# Altium schematic sheet Chov2_cpu.SchDoc
size A4; DocumentNumber: 2; SheetNumber: 2; SheetTotal: 3; LotOfPieces: 1
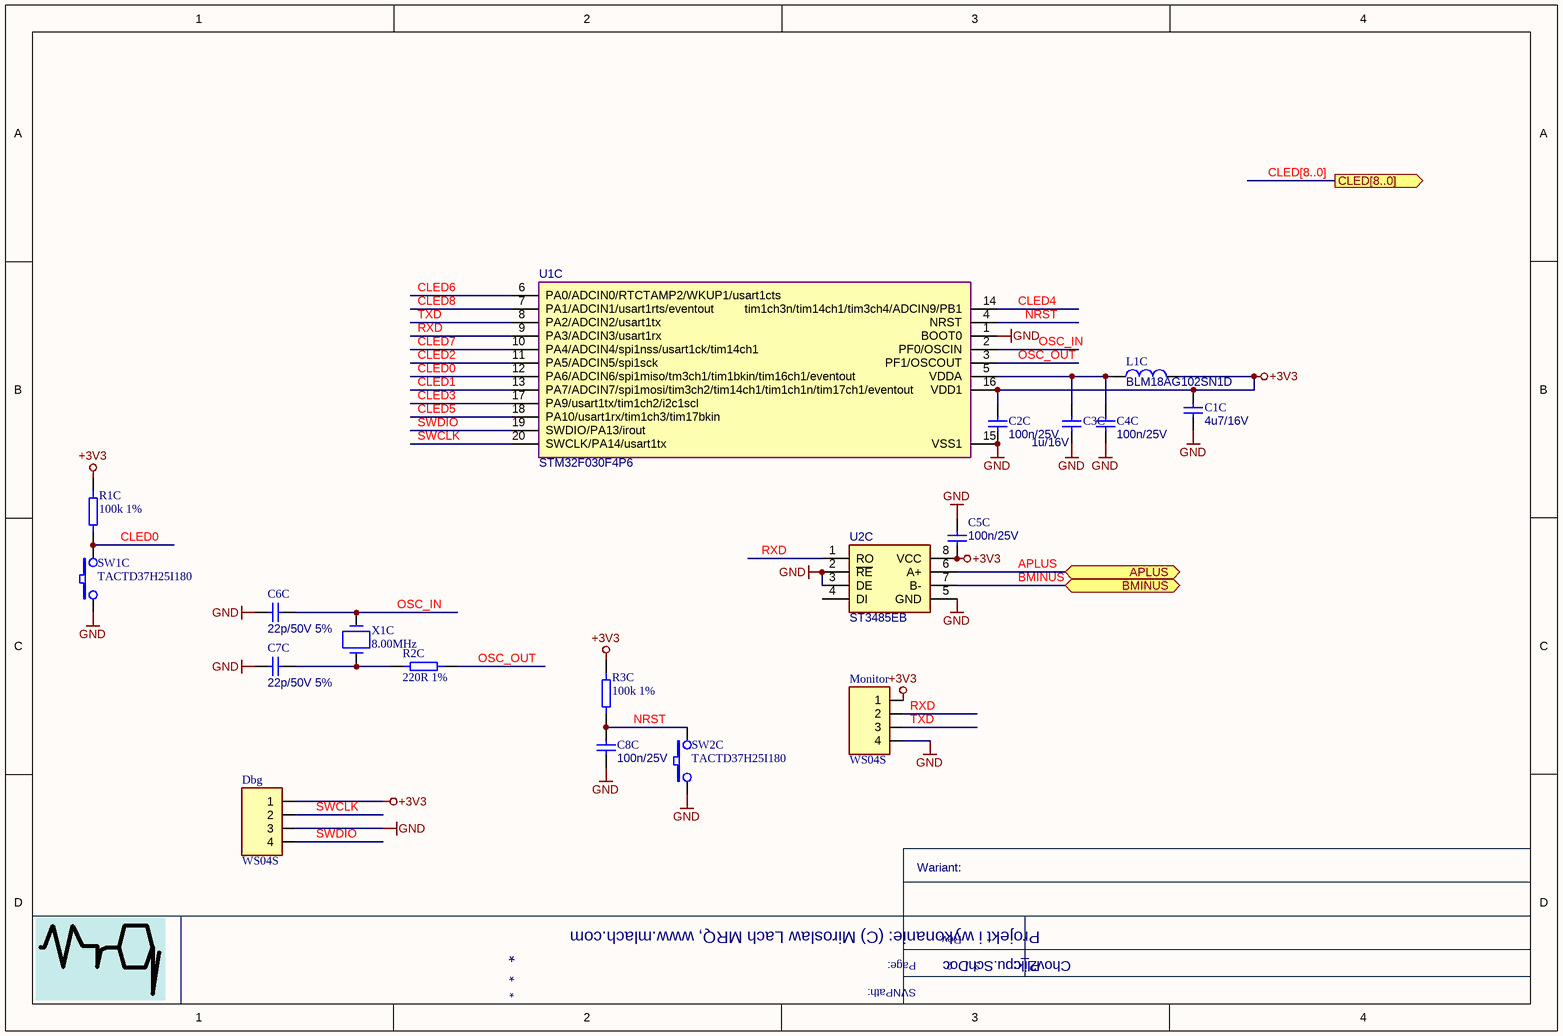
[diagram p0: Chov2_cpu.SchDoc]

## Parts
C1C  OtherParams: 4u7/16V  [0805]  (hidden comment: 0805YC475KAT2A)
C2C  OtherParams: 100n/25V  [0603-IPC]  (hidden comment: CL10B104KA8NNNC)
C3C  OtherParams: 1u/16V  [0603-IPC]  (hidden comment: CL10B105KO8NNNC)
C4C  OtherParams: 100n/25V  [0603-IPC]  (hidden comment: CL10B104KA8NNNC)
C5C  OtherParams: 100n/25V  [0603-IPC]  (hidden comment: CL10B104KA8NNNC)
C6C  OtherParams: 22p/50V 5%  [0603-IPC]  (hidden comment: CL10C220JB8NNNC)
C7C  OtherParams: 22p/50V 5%  [0603-IPC]  (hidden comment: CL10C220JB8NNNC)
C8C  OtherParams: 100n/25V  [0603-IPC]  (hidden comment: CL10B104KA8NNNC)
Dbg  WS04S  [WS04S]
L1C  BLM18AG102SN1D  [0603]
Monitor  WS04S  [WS04S]
R1C  OtherParams: 100k 1%  [0603-IPC]  (hidden comment: RC0603FR-07100KL)
R2C  OtherParams: 220R 1%  [0603-IPC]  (hidden comment: 0603SAF2200T5E)
R3C  OtherParams: 100k 1%  [0603-IPC]  (hidden comment: RC0603FR-07100KL)
SW1C  TACTD37H25I180  [TACTD37H25I180]
SW2C  TACTD37H25I180  [TACTD37H25I180]
U1C  STM32F030F4P6  [MO-153AC]
U2C  ST3485EB  [8SOIC150]
X1C  8.00MHz  [HC49SMP]

## Ports
APLUS, BMINUS, CLED[8..0]

## Nets
+3V3: C1C.1 C2C.1 C5C.1 Dbg.1 L1C.2 Monitor.1 R1C.1 R3C.1 U1C.16(VDD1) U2C.8(VCC)
GND: C1C.2 C2C.2 C3C.2 C4C.2 C5C.2 C6C.1 C7C.1 C8C.2 Dbg.3 Monitor.4 SW1C.1 SW2C.1 U1C.1(BOOT0) U1C.15(VSS1) U2C.2(~{RE}) U2C.3(DE) U2C.5(GND)
APLUS: U2C.6(A+) ; port APLUS
BMINUS: U2C.7(B-) ; port BMINUS
CLED0: R1C.2 SW1C.2 U1C.12(PA6/ADCIN6/spi1miso/tm3ch1/tim1bkin/tim16ch1/eventout)
CLED1: U1C.13(PA7/ADCIN7/spi1mosi/tim3ch2/tim14ch1/tim1ch1n/tim17ch1/eventout)
CLED2: U1C.11(PA5/ADCIN5/spi1sck)
CLED3: U1C.17(PA9/usart1tx/tim1ch2/i2c1scl)
CLED4: U1C.14(tim1ch3n/tim14ch1/tim3ch4/ADCIN9/PB1)
CLED5: U1C.18(PA10/usart1rx/tim1ch3/tim17bkin)
CLED6: U1C.6(PA0/ADCIN0/RTCTAMP2/WKUP1/usart1cts)
CLED7: U1C.10(PA4/ADCIN4/spi1nss/usart1ck/tim14ch1)
CLED8: U1C.7(PA1/ADCIN1/usart1rts/eventout)
NRST: C8C.1 R3C.2 SW2C.2 U1C.4(NRST)
OSC_IN: C6C.2 U1C.2(PF0/OSCIN) X1C.1
OSC_OUT: R2C.2 U1C.3(PF1/OSCOUT)
RXD: Monitor.2 U1C.9(PA3/ADCIN3/usart1rx) U2C.1(RO)
SWCLK: Dbg.2 U1C.20(SWCLK/PA14/usart1tx)
SWDIO: Dbg.4 U1C.19(SWDIO/PA13/irout)
TXD: Monitor.3 U1C.8(PA2/ADCIN2/usart1tx)
NetC3C_1: C3C.1 C4C.1 L1C.1 U1C.5(VDDA)
NetC7C_2: C7C.2 R2C.1 X1C.2

Not connected (* = marked no-connect by the designer): U2C 4(DI)

## Buses and harness runs
bus CLED[8..0] = port CLED[8..0]

## Notes on the sheet
- Wariant:
- Projekt i wykonanie: (C) Miroslaw Lach MRQ, www.mlach.com
- SVNPath:
- Page:
- Rev.
- /
- Plik:

## Library data of the parts
C1C = 0805YC475KAT2A[[/\]]0805[[/\]]16V[[/\]]10%[[/\]]4u7/16V: MaxVoltage: 16V; Tolerance: 10%; Descript: capacitor 4.7uF,16V, X7R, 0805; Currency5: PLN; Value: 0805YC475KAT2A; Dimensions: 0805; ComponentLink1Description: Datasheet; ComponentLink1URL: http://www.mrq-ml.com/Parts/Capacitors/AVX_smccp.pdf; Supplier5: tme.pl; Reference5: 0805YC475KAT2A; Manufacturer5: AVX; Typ5: 0805YC475KAT2A; Price5: 0,0249; DateOfPrice5: 2012-07-30
C2C C4C C5C C8C = CL10B104KA8NNNC[[/\]]0603[[/\]]25V[[/\]]10%[[/\]]100n/25V: MaxVoltage: 25V; Tolerance: 10%; Descript: Kondensator: ceramiczny; MLCC; 100nF; 25V; X7R; ±10%; SMD; 0603; Currency5: PLN; Value: CL10B104KA8NNNC; Dimensions: 0603; Supplier5: tme.pl; Reference5: CL10B104KA8NNNC; Manufacturer5: Samsung; Typ5: CL10B104KA8NNNC; Price5: 0,0239; DateOfPrice5: 2014-08-05
C3C = CL10B105KO8NNNC[[/\]]0603[[/\]]16V[[/\]]10%[[/\]]1u/16V: MaxVoltage: 16V; Tolerance: 10%; Descript: capacitor 1uF, 16V, 0603, 10%, X7R; Currency5: PLN; Value: CL10B105KO8NNNC; Dimensions: 0603; Supplier5: tme.pl; Reference5: CL10B105KO8NNNC; Manufacturer5: Samsung; Typ5: CL10B105KO8NNNC; Price5: 0,0299; DateOfPrice5: 2014-09-29; Price1: 0,0199
C6C C7C = CL10C220JB8NNNC[[/\]]0603[[/\]]50V[[/\]]5%[[/\]]22p/50V 5%: MaxVoltage: 50V; Tolerance: 5%; Descript: capacitor 22pF, 50V, 5%, 0603; Currency5: PLN; Value: CL10C220JB8NNNC; Dimensions: 0603; ComponentLink1Description: Datasheet; ComponentLink1URL: http://www.mrq-ml.com/Parts/Capacitors/mlcc_samsung.pdf; Supplier5: tme.pl; Reference5: CL10C220JB8NNNC; Manufacturer5: Samsung; Typ5: CL10C220JB8NNNC; Price5: 0,027; DateOfPrice5: 2012-02-08
Dbg Monitor = WS04S[[/\]]8x12mm: Descript: connector 2mm pitch, THT, 4 pole, straight, male; Currency5: PLN; Replacement: maritex: NXW-04; Value: WS04S; Dimensions: 8x12mm; ComponentLink1Description: Datasheet; ComponentLink1URL: http://www.mrq-ml.com/Parts/Connectors/WS-S.pdf; Supplier5: maritex.com.pl; Reference5: WS04S; Price5: 0,069; DateOfPrice5: 2012-09-18
L1C = BLM18AG102SN1D[[/\]]0603[[/\]]BLM18AG102SN1D: Descript: Chip inductor SMD, 0603, Imax=0.4A,Z=1000ohm,  Rdc=0.15ohm; Currency5: PLN; Value: BLM18AG102SN1D; OtherParams: BLM18AG102SN1D; Dimensions: 0603; Supplier5: tme.pl; Reference5: BLM18AG102SN1D; Manufacturer5: Murata; Typ5: BLM18AG102SN1D; Price5: 0,069; DateOfPrice5: 2014-10-18; Price1: 0,049
R1C = RC0603FR-07100KL[[/\]]0603[[/\]]0.1W[[/\]]1%[[/\]]100k 1%: DissPower: 0.1W; Tolerance: 1%; Descript: Resistor 100kohm, 0603, 1%; Currency5: PLN; Value: RC0603FR-07100KL; Dimensions: 0603; ComponentLink1Description: Datasheet; ComponentLink1URL: http://www.mrq-ml.com/Parts/Resistors/rc0603yageo.pdf; Supplier5: tme.pl; Reference5: RC0603FR-07100K; Manufacturer5: Yageo; Typ5: RC0603FR-07100KL; Price5: 0,029; DateOfPrice5: 2010-02-23
R2C = 0603SAF2200T5E[[/\]]0603[[/\]]0.1W[[/\]]1%[[/\]]220R 1%: DissPower: 0.1W; Tolerance: 1%; Descript: Resistor 220ohm, 0603, 1%; Reference5: SMD0603-220R-1%; Currency5: PLN; Value: 0603SAF2200T5E; Dimensions: 0603; ComponentLink1Description: Datasheet; ComponentLink1URL: http://www.mrq-ml.com/Parts/Resistors/RoyalOhm_rezystor-smd.pdf; Supplier5: tme.pl; Manufacturer5: Royal Ohm; Typ5: 0603SAF2200T5E; Price5: 0,025; DateOfPrice5: 2014-08-05
R3C = RC0603FR-07100KL[[/\]]0603[[/\]]0.1W[[/\]]1%[[/\]]100k 1%: Descript: Resistor 100kohm, 0603, 1%; DissPower: 0.1W; Tolerance: 1%; Currency5: PLN; Value: RC0603FR-07100KL; Dimensions: 0603; ComponentLink1Description: Datasheet; ComponentLink1URL: http://www.mrq-ml.com/Parts/Resistors/rc0603yageo.pdf; Supplier5: tme.pl; Reference5: RC0603FR-07100K; Manufacturer5: Yageo; Typ5: RC0603FR-07100KL; Price5: 0,029; DateOfPrice5: 2010-02-23
SW1C SW2C = TACTD37H25I180[[/\]]TACTD37H25I180[[/\]]3.7x6.1x2.5: Descript: TACT switch 3.7x6.1x2.5, SMD, dustproof; Currency5: PLN; Amount5: 1+; Value: TACTD37H25I180; Dimensions: 3.7x6.1x2.5; ComponentLink1Description: Datasheet; ComponentLink1URL: http://www.mrq-ml.com/Parts/Electromechanical/TACTD37H25I.pdf; Supplier5: maritex.com.pl; Reference5: TACTD37H25I180; Manufacturer5: www.innocentswitch.co.kr; Price5: 0,54; DateOfPrice5: 2012-11-24; OtherParams: TACTD37H25I180; Price1: 0,49
U1C = STM32F030F4P6[[/\]]MO-153AC: Descript: ARM Cortex-M0 CPU, 16kB Flash, 4kB RAM, UART, I2C, SPI, ADC, TSSOP20, STM, RoHS; Currency5: PLN; Value: STM32F030F4P6; Dimensions: MO-153AC; Supplier5: kamami.pl; Reference5: STM32F030F4P6; Manufacturer5: ST; Typ5: STM32F030F4P6; Price5: 3,813; DateOfPrice5: 2014-10-23
U2C = ST3485EB[[/\]]8SOIC150: Descript: 3.3V powered, 15kV ESD protected, up to 12Mbps RS485/RS422 transceiver; Reference5: ST3485EBD; Currency5: PLN; Value: ST3485EB; Price1: 3,5; Dimensions: 8SOIC150; ComponentLink1Description: Datasheet; ComponentLink1URL: http://www.mrq-ml.com/Parts/ICs/ST3485.pdf; Supplier5: tme.pl; Manufacturer5: ST; Typ5: ST3485EBD; Price5: 3,89; DateOfPrice5: 2013-08-26
X1C = 8.00MHz[[/\]]HC49/4HSMX[[/\]]8.00MHz: Descript: crystal 8MHz, 1; Reference5: 8.00M-SMDHC49S; Currency5: PLN; Value: 8.00MHz; OtherParams: 8.00MHz; Dimensions: HC49/4HSMX; Price1: 0,8900; Supplier5: tme.pl; Price5: 1,49; DateOfPrice5: 2014-09-09; Manufacturer5: YIC